# EAGLE design matrix_shield (EAGLE 5.10)
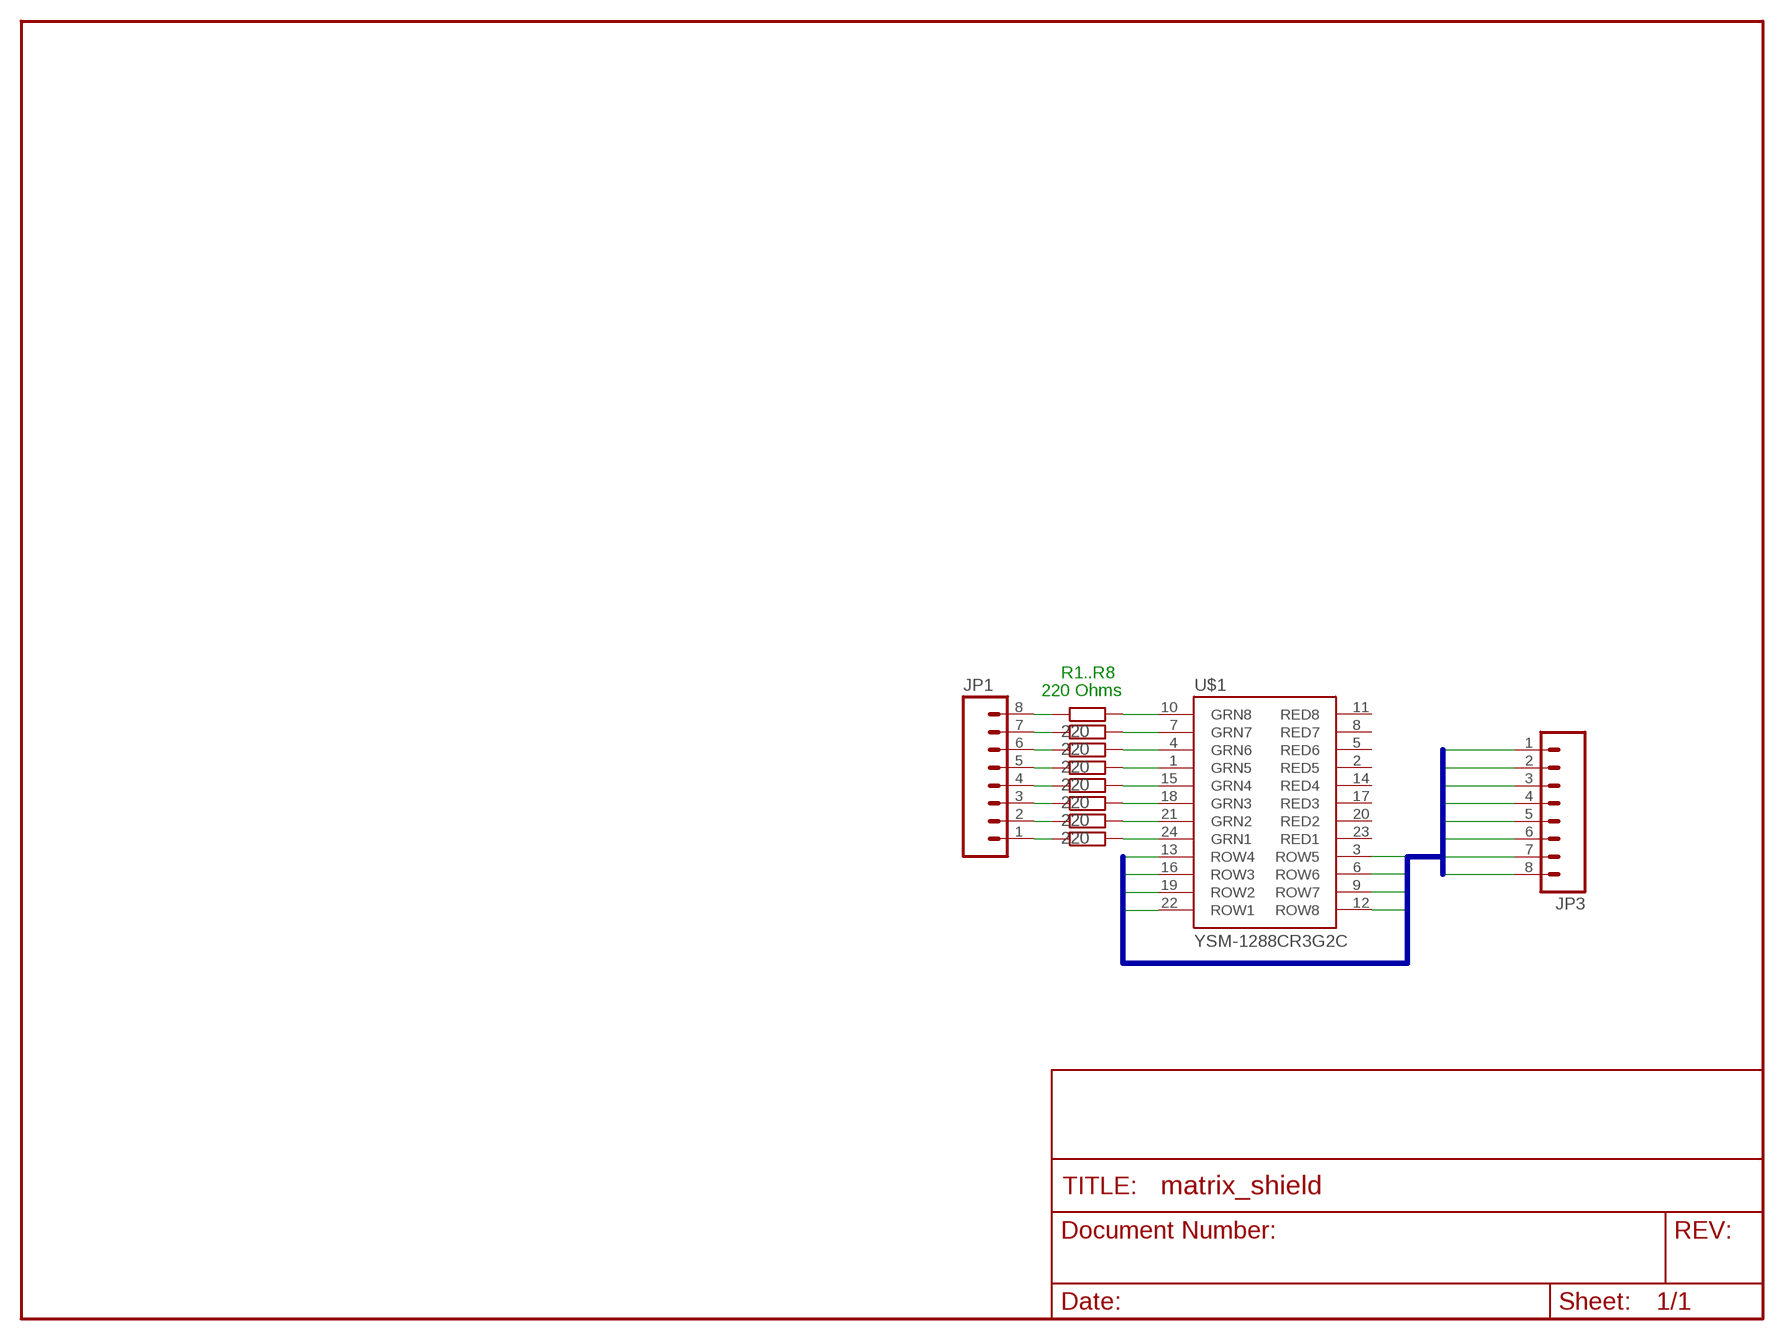
[diagram p0: schematic, sheet 1]

## Parts
JP1  M08  [1X08]
JP3  M08  [1X08]
R1  220  R-EU_0207/10  [0207/10]
R2  220  R-EU_0207/10  [0207/10]
R3  220  R-EU_0207/10  [0207/10]
R4  220  R-EU_0207/10  [0207/10]
R5  220  R-EU_0207/10  [0207/10]
R6  220  R-EU_0207/10  [0207/10]
R7  220  R-EU_0207/10  [0207/10]
R8  220  R-EU_0207/10  [0207/10]
U$1  YSM-1288CR3G2C  [YSM-1288CR3G2C]

## Nets
COL1: R8.2 U$1.24(GRN1)
COL2: R7.2 U$1.21(GRN2)
COL3: R6.2 U$1.18(GRN3)
COL4: R5.2 U$1.15(GRN4)
COL5: R4.2 U$1.1(GRN5)
COL6: R3.2 U$1.4(GRN6)
COL7: R2.2 U$1.7(GRN7)
COL8: R1.2 U$1.10(GRN8)
N$1: JP1.8 R1.1
N$2: JP1.7 R2.1
N$3: JP1.6 R3.1
N$4: JP1.5 R4.1
N$5: JP1.4 R5.1
N$6: JP1.3 R6.1
N$7: JP1.2 R7.1
N$8: JP1.1 R8.1
ROW1: JP3.1 U$1.22(ROW1)
ROW2: JP3.2 U$1.19(ROW2)
ROW3: JP3.3 U$1.16(ROW3)
ROW4: JP3.4 U$1.13(ROW4)
ROW5: JP3.5 U$1.3(ROW5)
ROW6: JP3.6 U$1.6(ROW6)
ROW7: JP3.7 U$1.9(ROW7)
ROW8: JP3.8 U$1.12(ROW8)
Unconnected: U$1.2(RED5) U$1.5(RED6) U$1.8(RED7) U$1.11(RED8) U$1.14(RED4) U$1.17(RED3) U$1.20(RED2) U$1.23(RED1)

## Buses
ROW[1..8]

## Notes on the sheet
- R1..R8
- 220 Ohms

## Library data of the parts
JP1 JP3 = SparkFun:M08: Header 8 Standard 8-pin 0.1" header. Use with straight break away headers (SKU : PRT-00116), right angle break away headers (PRT-00553), swiss pins (PRT-00743), machine pins (PRT-00117), and female headers (PRT-00115).
R1-R8 = rcl:R-EU_: RESISTOR, European symbol
U$1 = led-matrix-v3:YSM-1288CR3G2C: LED Matrix - Dual Color (Red + Green) - Small sku: COM-00681 0.275 x 1.25 x 1.25"

## Board
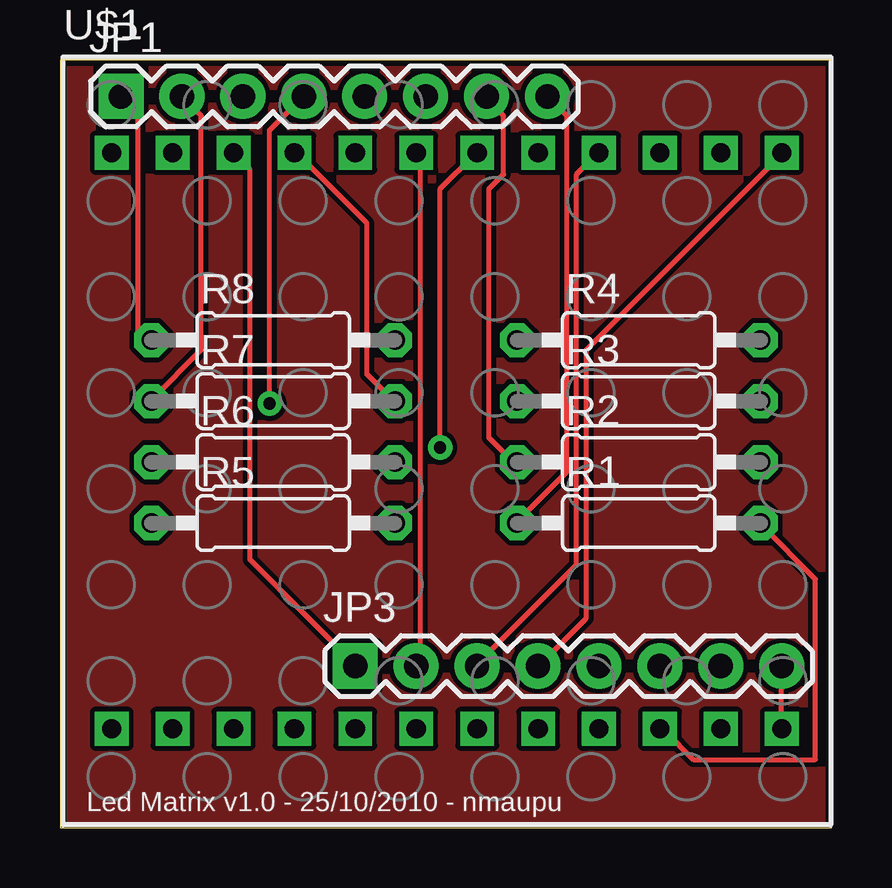
[diagram p1: board, top side]
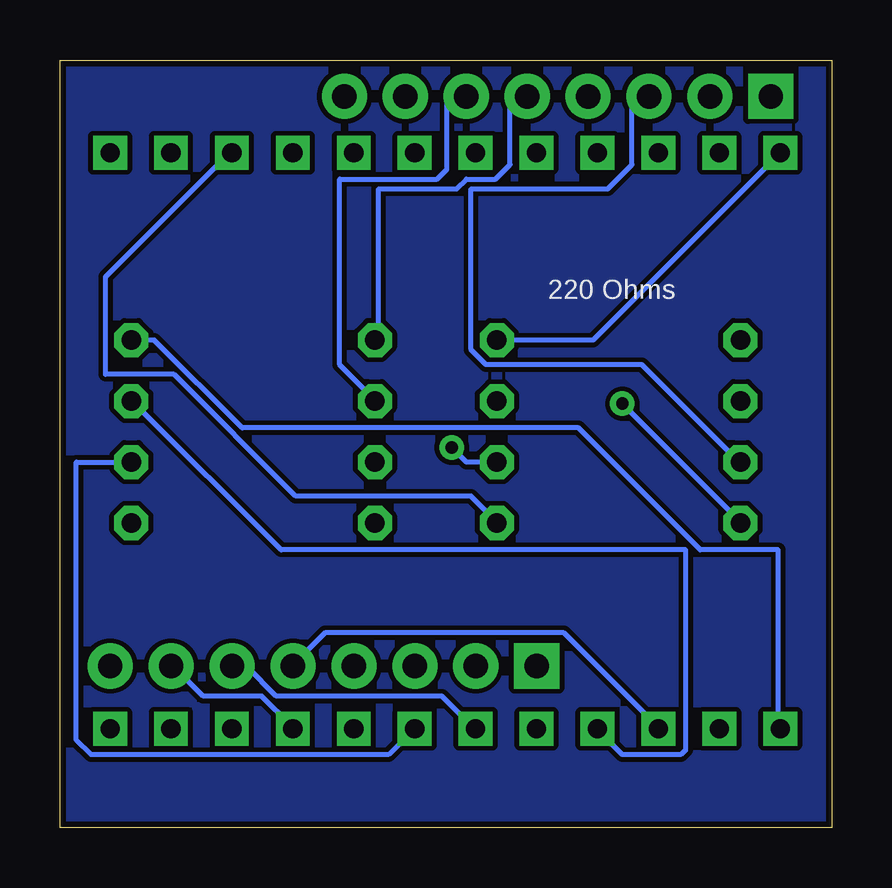
[diagram p2: board, bottom side, seen from below]

Size 32.18 x 31.99 mm. Coordinates in mm from the lower left corner, seen from the top.
Outline: 0,0 32.18,0 32.18,31.99 0,31.99 0,0
Copper layers (1*16): Top 0.035mm / dielectric 1.5mm / Bottom 0.035mm
Design rules "sparkfun": minimum track width 8mil, minimum drill 20mil, track to track 8mil, track to pad 8mil, pad to pad 8mil, via to via 8mil, smd to smd 8mil, copper to edge 10mil, drill to drill 8mil, minimum pad ring 12mil, minimum via ring 10mil, stop-mask expansion 4mil, vias tented up to drill 0mil, thermal gap 10mil

### Footprints (pad centres in the part's own frame; a part is rotated, then mirrored left to right if it is on the bottom)
1X08 = drill 1.016 pad 1.88 square: 1 0,0 | drill 1.016 pad 1.88 round: 2 2.54,0; 3 5.08,0; 4 7.62,0; 5 10.16,0; 6 12.7,0; 7 15.24,0; 8 17.78,0
0207/10 = drill 0.813 octagon: 1 -5.08,0; 2 5.08,0
YSM-1288CR3G2C = drill 0.8 square: 1 -13.975,-12; 2 -11.435,-12; 3 -8.895,-12; 4 -6.355,-12; 5 -3.815,-12; 6 -1.275,-12; 7 1.265,-12; 8 3.805,-12; 9 6.345,-12; 10 8.885,-12; 11 11.425,-12; 12 13.965,-12; 13 13.965,12; 14 11.425,12; 15 8.885,12; 16 6.345,12; 17 3.805,12; 18 1.265,12; 19 -1.275,12; 20 -3.815,12; 21 -6.355,12; 22 -8.895,12; 23 -11.435,12; 24 -13.975,12

### Placement (x,y rotation side)
JP1  2.54,30.48 0 top
JP3  12.31,6.74 0 top
R1  24.13,12.7 0 top
R2  24.13,15.24 0 top
R3  24.13,17.78 0 top
R4  24.13,20.32 0 top
R5  8.89,12.7 0 top
R6  8.89,15.24 0 top
R7  8.89,17.78 0 top
R8  8.89,20.32 0 top
U$1  16.13,16.13 0 top

### Tracks (layer width: path | path; a pad name or v marks a point on that pad's centre or on a via)
COL1
  Bottom 0.203: U$1.24 2.23,28.04 9.96,20.32 R8.2
COL2
  Top 0.203: U$1.21 9.96,28.04 12.8,25.2 12.8,18.9 13.82,17.88 R7.2
COL3  (via drill 0.51)
  Top 0.203: v15.85,15.85 15.85,26.62 17.27,28.04 U$1.18
  Bottom 0.203: v15.85,15.85 15.24,15.24 R6.2
COL4
  Bottom 0.203: U$1.15 25.2,28.04 30.28,22.96 30.28,18.9 27.43,18.9 22.35,13.82 15.04,13.82 14.02,12.8 R5.2
COL5
  Bottom 0.203: U$1.1 2.23,4.27 2.23,11.58 5.49,11.58 10.57,16.66 24.59,16.66 28.25,20.32 R4.2
COL6
  Bottom 0.203: U$1.4 9.75,4.06 8.74,3.05 6.3,3.05 6.1,3.25 6.1,11.58 22.96,11.58 29.06,17.68 R3.2
COL7
  Bottom 0.203: U$1.7 17.48,4.06 18.49,3.05 30.89,3.05 31.5,3.66 31.5,15.24 R2.2
COL8
  Top 0.203: U$1.10 25.2,4.06 26.42,2.85 31.5,2.85 31.5,10.36 29.26,12.6 R1.2
GND
  pour Bottom: 0,31.75 31.75,31.75 31.75,0 0,0
  pour Top: 0,31.75 31.75,31.75 31.75,0 0,0
N$1
  Top 0.203: R1.1 19.1,12.8 21.13,14.83 21.13,29.67 20.52,30.28 JP1.8
N$2
  Top 0.203: R2.1 18.9,15.24 17.88,16.26 17.88,26.62 18.49,27.23 18.49,29.67 17.88,30.28 JP1.7
N$3
  Bottom 0.203: R3.1 19.1,17.88 20.52,19.3 20.52,27.03 16.46,27.03 16.05,27.43 16.05,30.28 15.44,30.28 JP1.6
N$4
  Bottom 0.203: R4.1 18.9,20.32 18.9,26.62 15.65,26.62 15.24,27.03 14.02,27.03 13.41,27.64 13.41,30.28 12.8,30.28 JP1.5
N$5  (via drill 0.51)
  Top 0.203: v8.74,17.68 8.74,29.06 JP1.4
  Bottom 0.203: v8.74,17.68 3.86,12.8 R5.1
N$6
  Bottom 0.203: R6.1 3.86,15.24 7.92,19.3 14.43,19.3 15.04,19.91 15.04,26.62 9.35,26.62 8.33,27.64 8.33,30.28 7.72,30.28 JP1.3
N$7
  Top 0.203: R7.1 3.86,17.88 5.89,19.91 5.89,29.67 5.28,30.28 JP1.2
N$8
  Top 0.203: R8.1 3.66,20.32 3.25,20.73 3.25,29.67 2.64,30.28 JP1.1
ROW1
  Top 0.203: U$1.22 7.32,28.04 7.92,27.43 7.92,11.18 12.19,6.91 JP3.1
ROW2
  Top 0.203: U$1.19 15.04,28.04 15.04,6.91 JP3.2
ROW3
  Top 0.203: U$1.16 22.35,28.04 21.54,27.23 21.54,10.97 17.48,6.91 JP3.3
ROW4
  Top 0.203: U$1.13 30.07,28.04 21.95,19.91 21.95,8.74 20.12,6.91 JP3.4
ROW5
  Bottom 0.203: U$1.3 7.32,4.27 11.18,8.13 21.13,8.13 22.35,6.91 JP3.5
ROW6
  Bottom 0.203: U$1.6 15.04,4.27 16.26,5.49 23.16,5.49 24.38,6.71 24.99,6.71 JP3.6
ROW7
  Bottom 0.203: U$1.9 22.55,4.27 23.77,5.49 26.21,5.49 27.43,6.71 JP3.7
ROW8
  Top 0.203: U$1.12 30.07,4.27 30.07,6.71 JP3.8

### Text on the board
tPlace: Led Matrix v1.0 - 25/10/2010 - nmaupu
bPlace: 220 Ohms